# Altium project IBUS_BT_1.01.PrjPcb
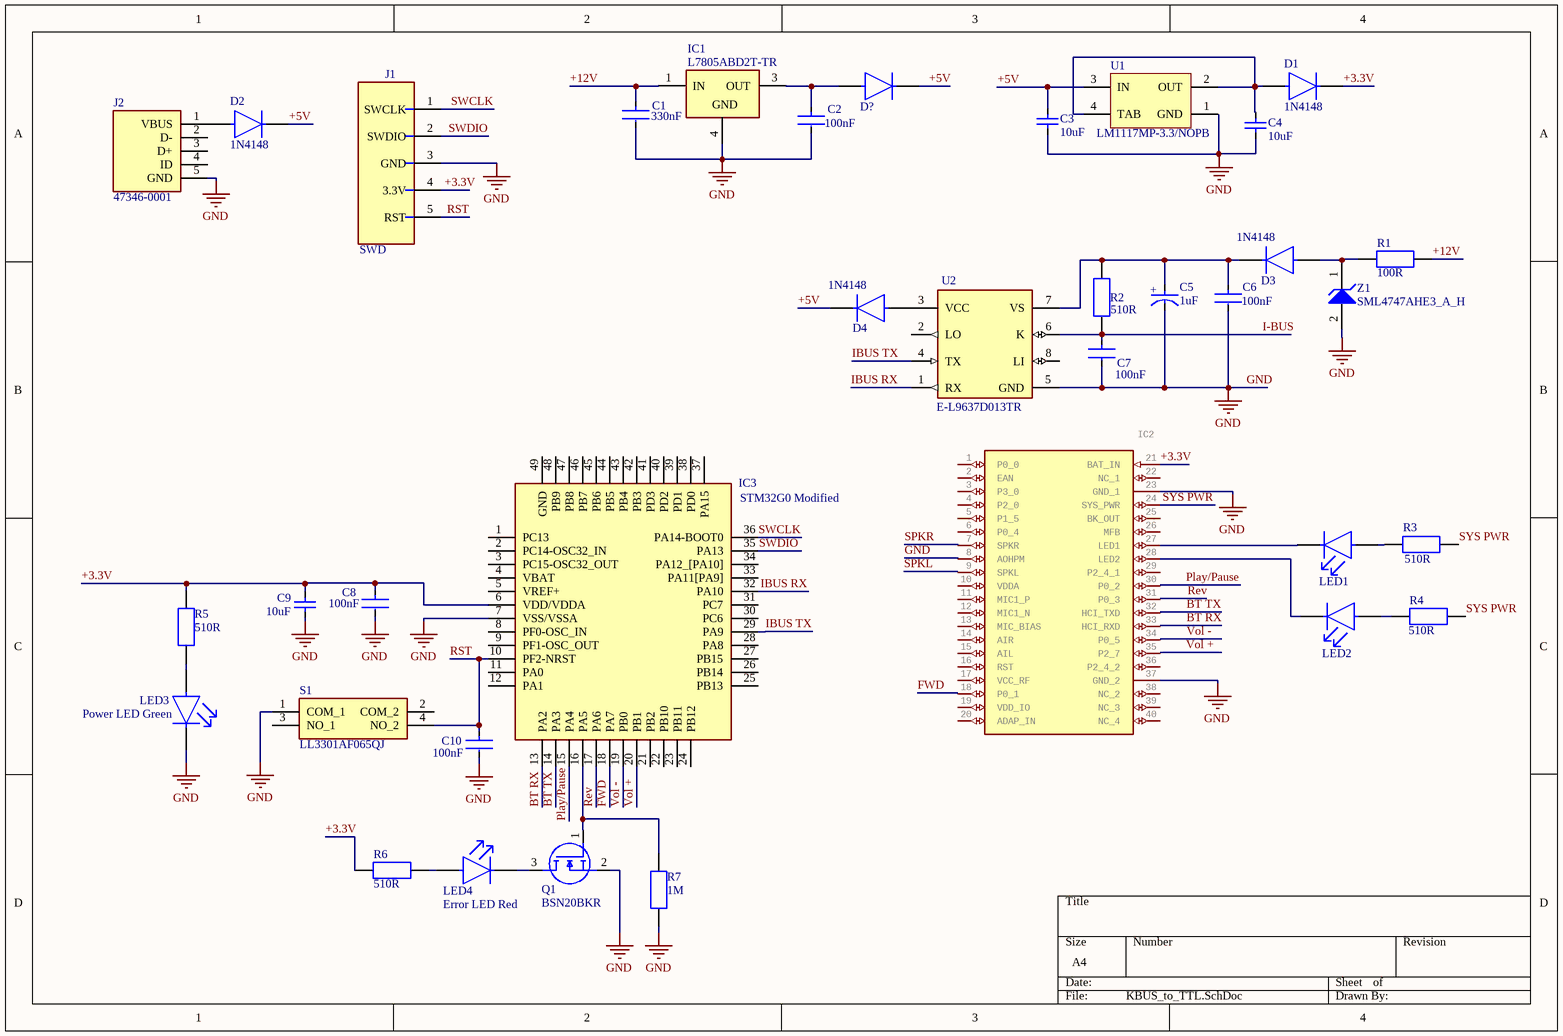
[diagram p0: KBUS_to_TTL.SchDoc]
1 sheet, 36 parts. Net scope: global (net labels, ports and power ports of the same name join across sheets).
Board file: KBUS_to_TTL.PcbDoc

## Sheet KBUS_to_TTL.SchDoc
size A4

### Parts
C1  330nF  [KEMET_C1206C-EB_IPC_B]
C2  100nF  [KEMET_C1206C-EB_IPC_B]
C3  10uF  [CAPC1608N]
C4  10uF  [CAPC1608N]
C5  1uF  [Panasonic_SB_MFG]
C6  100nF  [KEMET_C1206C-EB_IPC_B]
C7  100nF  [KEMET_C1206C-EB_IPC_B]
C8  100nF  [KEMET_C1206C-EB_IPC_B]
C9  10uF  [CAPC1608N]
C10  100nF  [KEMET_C1206C-EB_IPC_B]
D1  1N4148  [Diodes_Inc._SOD323F_MFG]
D2  1N4148  [Diodes_Inc._SOD323F_MFG]
D3  1N4148  [Diodes_Inc._SOD323F_MFG]
D4  1N4148  [Diodes_Inc._SOD323F_MFG]
D?  1N4148WSF-7  [Diodes_Inc._SOD323F_MFG]  (value not drawn)
IC1  L7805ABD2T-TR  [D2PAK-STB35NF10T4]
IC2  BM20SPKA1NBC-0001AA  [BM20SPKA1NBC0001AA]  (value not drawn)
IC3  STM32G0 Modified  [QFN50P700X700X60-49N-D]
J1  SWD  [Tyco_640455-5_0]
J2  47346-0001  [47346-0001]
LED1  5988170107F  [Dialight_0_MFG]  (value not drawn)
LED2  5988170107F  [Dialight_0_MFG]  (value not drawn)
LED3  Power LED Green  [Dialight_0_MFG]
LED4  Error LED Red  [Dialight_598_0]
Q1  BSN20BKR  [SOT96P240X110-3N]
R1  100R  [RESC3216N]
R2  510R  [Vishay_CRCW1206-e3_IPC_B]
R3  510R  [Vishay_CRCW1206-e3_IPC_B]
R4  510R  [Vishay_CRCW1206-e3_IPC_B]
R5  510R  [Vishay_CRCW1206-e3_IPC_B]
R6  510R  [Vishay_CRCW1206-e3_IPC_B]
R7  1M  [RESC3216N]
S1  LL3301AF065QJ  [LL3301FF065QJ]
U1  LM1117MP-3.3/NOPB  [MP04A_N]
U2  E-L9637D013TR  [STMicroelectronics_SO8-0016023_IPC_A]
Z1  SML4747AHE3_A_H  [DIONM5127X229N]

### Nets
GND: C1.2 C2.2 C3.2 C4.2 C5.1(C) C6.2 C7.2 C8.2 C9.1 C10.2 IC1.4(GROUND) IC2.23(GND_1) IC2.37(GND_2) IC3.7(VSS/VSSA) J1.3(GND) J2.5(GND) LED3.1(C) Q1.2(S) R7.1 S1.1(COM_1) U2.5(GND) Z1.2(A)
+3.3V: C8.1 C9.2 D1.1(C) IC2.21(BAT_IN) IC3.6(VDD/VDDA) J1.4(3.3V) R5.1 R6.1
+5V: C3.1 D2.1(C) D4.1(C) D?.1(C) U1.3(IN)
+12V: C1.1 IC1.1(IN) R1.2
BT RX: IC3.13(PA2)
BT TX: IC3.14(PA3)
FWD: IC3.18(PA7)
I-BUS: C7.1 R2.1 U2.6(K)
IBUS RX: IC3.32(PA10) U2.1(RX)
IBUS TX: IC3.29(PA9) U2.4(TX)
Play/Pause: IC3.15(PA4)
Rev: IC3.17(PA6)
RST: C10.1 IC3.10(PF2-NRST) J1.5(RST) S1.4(NO_2)
SWCLK: IC3.36(PA14-BOOT0) J1.1(SWCLK)
SWDIO: IC3.35(PA13) J1.2(SWDIO)
SYS PWR: IC2.24(SYS_PWR) R3.2 R4.2
Vol +: IC3.20(PB1)
Vol -: IC3.19(PB0)
NetC2_1: C2.1 D?.2(A) IC1.3(OUT)
NetC4_1: C4.1 D1.2(A) U1.2(OUT) U1.4(TAB)
NetC5_2: C5.2(A) C6.1 D3.1(C) R2.2 U2.7(VS)
NetD2_2: D2.2(A) J2.1(VBUS)
NetD3_2: D3.2(A) R1.1 Z1.1(K)
NetD4_2: D4.2(A) U2.3(VCC)
NetIC2_27: IC2.27(LED1) LED1.1(C)
NetIC2_28: IC2.28(LED2) LED2.1(C)
NetIC3_16: IC3.16(PA5) Q1.1(G) R7.2
NetLED1_2: LED1.2(A) R3.1
NetLED2_2: LED2.2(A) R4.1
NetLED3_2: LED3.2(A) R5.2
NetLED4_1: LED4.1(C) Q1.3(D)
NetLED4_2: LED4.2(A) R6.2

Not connected (* = marked no-connect by the designer): IC2 1(P0_0) 2(EAN) 3(P3_0) 4(P2_0) 5(P1_5) 6(P0_4) 7(SPKR) 8(AOHPM) 9(SPKL) 10(VDDA) 11(MIC1_P) 12(MIC1_N) 13(MIC_BIAS) 14(AIR) 15(AIL) 16(RST) 17(VCC_RF) 18(P0_1) 19(VDD_IO) 20(ADAP_IN) 22(NC_1) 25(BK_OUT) 26(MFB) 29(P2_4_1) 30(P0_2) 31(P0_3) 32(HCI_TXD) 33(HCI_RXD) 34(P0_5) 35(P2_7) 36(P2_4_2) 38(NC_2) 39(NC_3) 40(NC_4); IC3 1(PC13) 2(PC14-OSC32_IN) 3(PC15-OSC32_OUT) 4(VBAT) 5(VREF+) 8(PF0-OSC_IN) 9(PF1-OSC_OUT) 11(PA0) 12(PA1) 21(PB2) 22(PB10) 23(PB11) 24(PB12) 25(PB13) 26(PB14) 27(PB15) 28(PA8) 30(PC6) 31(PC7) 33(PA11[PA9]) 34(PA12_[PA10]) 37(PA15) 38(PD0) 39(PD1) 40(PD2) 41(PD3) 42(PB3) 43(PB4) 44(PB5) 45(PB6) 46(PB7) 47(PB8) 48(PB9) 49(GND); J2 2(D-) 3(D+) 4(ID); S1 2(COM_2) 3(NO_1); U1 1(GND); U2 2(LO) 8(LI)

### Notes on the sheet
- (in symbol EEE1HA010SR) +
- (in symbol L7805ABD2T-TR) GND

### Library data of the parts
C1 = C1206C334K3RACTU: Kemet C1206, 330nF, 25VDC, X7R
C2 C6-C8 C10 = C1206C104M5RACTU: Kemet C1206, 100nF, 50VDC, X7R
C3 C4 C9 = GRM188R61C106KAALD: CAP MLCC, 10uF, 16V, 0603 [1608 Metric], ±10%, X5R; Manufacturer: MURATA; Value: 10uF; Package: 0603 [1608 Metric]; Manufacturer Part Number: GRM188R61C106KAALD; Supplier 1: Farnell; Supplier Part Number 1: 2611923; ComponentLink1Description: Datasheet; ComponentLink1URL: https://4donline.ihs.com/images/VipMasterIC/IC/MURE/MURE-S-A0004349797/MURE-S-A0004352506-1.pdf?hkey=6D3A4C79FDBF58556ACFDE234799DDF0; Voltage: 16V; Tolerance: ± 10%; Dielectric: X5R; Mounting: SMD; Part Type: MLCC
C5 = EEE1HA010SR: 1uF electrolytic capacitor
D1-D4 = 1N4148WSF-7
D? = 1N4148WSF-7: Small Signal Diode, 100 V, 250 mA; Manufacturer: DIODES INC; Manufacturer Part Number: 1N4148WSF-7; Supplier 1: Farnell; Supplier Part Number: 3127172; Mounting: SMD; ComponentLink1Description: Datasheet; ComponentLink1URL: https://www.farnell.com/datasheets/2705170.pdf
IC1 = L7805ABD2T-TR: Integrated Circuit; Manufacturer_Name: STMicroelectronics; Datasheet Link: https://www.st.com/resource/en/datasheet/l78.pdf; Manufacturer_Part_Number: L7805ABD2T-TR
IC2 = BM20SPKA1NBC-0001AA: Bluetooth Module, Class 2, BLE 5.0; Manufacturer: Microchip; Manufacturer Part Number: BM20SPKA1NBC-0001AA; Supplier 1: Farnell; Supplier Part Number: 3580727; Mounting: SMD; ComponentLink1Description: Datasheet; ComponentLink1URL: https://4donline.ihs.com/images/VipMasterIC/IC/MCHP/MCHP-S-A0008919503/MCHP-S-A0008920188-1.pdf?hkey=6D3A4C79FDBF58556ACFDE234799DDF0
IC3 = STM32G0 Modified: Integrated Circuit; Manufacturer: STMicroelectronics; Manufacturer Part Number: STM32G071CBU6; Supplier 1: Mouser; Supplier Part Number: 511-STM32G071CBU6; ComponentLink1Description: Datasheet; ComponentLink1URL: https://www.mouser.co.uk/datasheet/2/389/dm00412180-1799303.pdf
J1 = 640455-5: ST-LINK
J2 = 47346-0001: Connector; Manufacturer_Name: Molex; Datasheet Link: http://www.molex.com/pdm_docs/sd/473460001_sd.pdf; Manufacturer_Part_Number: 47346-0001; Mouser Part Number: 538-47346-0001; Mouser Price/Stock: https://www.mouser.co.uk/ProductDetail/Molex/47346-0001?qs=c2CV6XM0DweJBWaSeyWeCw%3D%3D
LED1-LED3 = 5988170107F: Green LED; Manufacturer: DIALIGHT; Manufacturer Part Number: 5988170107F; Supplier 1: Farnell; Supplier Part Number: 1465996; Mounting: SMD; ComponentLink1Description: Datasheet; ComponentLink1URL: https://www.farnell.com/datasheets/1484480.pdf
LED4 = 598-8110-107F: Red LED; Manufacturer: DIALIGHT; Manufacturer Part Number: 5988110107F; Supplier 1: Farnell; Supplier Part Number: 1465992; Mounting: SMD; ComponentLink1Description: Datasheet; ComponentLink1URL: https://www.farnell.com/datasheets/1484480.pdf
Q1 = BSN20-7: MOSFET (N-Channel); Manufacturer: DIODES INC; Manufacturer Part Number: BSN20-7; Supplier 1: Mouser; Supplier Part Number: 621-BSN20-7; Mounting: SMD; ComponentLink1Description: Datasheet; ComponentLink1URL: https://www.diodes.com/assets/Datasheets/ds31898.pdf
R1 = RC1206FR-07100RL: RES 100R, ±1%, 250mW, 200V, 1206 [3216 Metric], Thick Film; Manufacturer: YAGEO; Temperature Coefficient: ± 100ppm/°C; Value: 100R; Manufacturer Part Number: RC1206FR-07100RL; Supplier 1: Farnell; Supplier Part Number 1: 9240888; Tolerance: ± 1%; Power: 250mW; Voltage: 200V; Package: 1206 [3216 Metric]; Part Type: Thick Film; ComponentLink1Description: Datasheet; ComponentLink1URL: http://www.farnell.com/datasheets/2167052.pdf; Mounting: SMD
R2-R6 = CRCW1206510RJNEA: Resistor 1206, 510ohm, 5%, 1/4W
R7 = MC009412: RES 1M, ±0,1%, 125mW, 150V, 1206 [3216 Metric], Thin Film; Manufacturer: MULTICOMP PRO; Tolerance: ± 0,1%; Value: 1M; Manufacturer Part Number: MC009412; Supplier 1: Farnell; Supplier Part Number 1: 2988394; Power: 125mW; Voltage: 150V; Package: 1206 [3216 Metric]; Part Type: Thin Film; ComponentLink1Description: Datasheet; ComponentLink1URL: https://www.farnell.com/datasheets/2861105.pdf; Mounting: SMD
S1 = LL3301AF065QJ: Switch; Manufacturer_Name: E-Switch; Datasheet Link: https://media.digikey.com/pdf/Data%20Sheets/E-Switch%20PDFs/LL3301AF065QJ.pdf; Height: 7.3mm; Manufacturer_Part_Number: LL3301AF065QJ
U1 = LM1117MP-3.3/NOPB: 800mA Low-Dropout Linear Regulator, 4-pin SOT-223, Pb-Free; Manufacturer: National Semiconductor; PackageTopMarking: XYTT*N05A; CompType: LDO IC; PowerWise: N; ComponentLink1Description: LM1117 Datasheet; ComponentLink2Description: LM1117 Web Page; DatasheetVersion: Apr-2006; ComponentLink3URL: http://www.national.com/packaging/folders/mp04a.html; ComponentLink1URL: http://www.national.com/ds/LM/LM1117.pdf; ComponentLink2URL: http://www.national.com/pf/LM/LM1117.html; Code_JEDEC: TO-261-AA; RevisionNote: Component URLs added; Code_IPC: SOT223-4; ComponentLink3Description: MP04A Package Page; PackageVersion: revB, Apr-2003; PackageDescription: Molded SOT-223, 6.50 x 3.56 x 1.6mm Body, 4 Lead, 2.3mm Pitch; PinCount: 4; RoHS: Y; PackageReference: MP04A; PartNumber: LM1117MP-3.3/NOPB
U2 = E-L9637D013TR: Bidirectional Serial Communication in Automotive Diagnostic System; Manufacturer: STMicroelectronics; ComponentLink1Description: Datasheet; ComponentLink1URL: https://www.farnell.com/datasheets/2815827.pdf; Manufacturer Part Number: E-L9637D013TR; Supplier 1: Farnell; Supplier Part Number: 3130050; Mounting: SMD
Z1 = SML4747AHE3_A_H: Zener Diode; Manufacturer: Vishay; Manufacturer Part Number: SML4747AHE3_A/H; Voltage: 20V; Supplier 1: Farnell; Supplier Part Number: 3818758; ComponentLink1Description: Datasheet; ComponentLink1URL: https://4donline.ihs.com/images/VipMasterIC/IC/VISH/VISH-S-A0012939441/VISH-S-A0013145027-1.pdf?hkey=6D3A4C79FDBF58556ACFDE234799DDF0